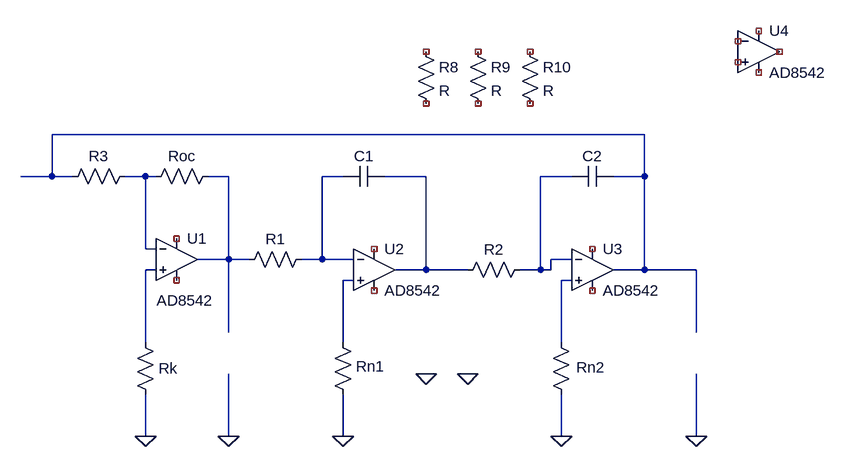
[diagram p0: schematic 3bandFLTR.asc]
3bandFLTR.asc, the LTspice schematic file:
Version 4
SHEET 1 944 680
WIRE 656 -64 -256 -64
WIRE -256 0 -256 -64
WIRE -256 0 -304 0
WIRE -224 0 -256 0
WIRE -112 0 -144 0
WIRE -96 0 -112 0
WIRE 16 0 -16 0
WIRE 192 0 160 0
WIRE 320 0 256 0
WIRE 544 0 496 0
WIRE 656 0 656 -64
WIRE 656 0 608 0
WIRE -112 112 -112 0
WIRE -96 112 -112 112
WIRE 16 128 16 0
WIRE 16 128 -32 128
WIRE 48 128 16 128
WIRE 160 128 160 0
WIRE 160 128 128 128
WIRE 208 128 160 128
WIRE 544 128 512 128
WIRE -96 144 -112 144
WIRE 320 144 320 0
WIRE 320 144 272 144
WIRE 384 144 320 144
WIRE 496 144 496 0
WIRE 496 144 464 144
WIRE 512 144 512 128
WIRE 512 144 496 144
WIRE 656 144 656 0
WIRE 656 144 608 144
WIRE 736 144 656 144
WIRE 208 160 192 160
WIRE 544 160 528 160
WIRE 16 240 16 128
WIRE 736 240 736 144
WIRE -112 256 -112 144
WIRE 192 256 192 160
WIRE 528 256 528 160
WIRE -112 400 -112 336
WIRE 16 400 16 304
WIRE 192 400 192 336
WIRE 528 400 528 336
WIRE 736 400 736 304
FLAG -112 400 0
FLAG 736 400 0
FLAG 192 400 0
FLAG 320 304 0
FLAG 384 304 0
FLAG 16 400 0
FLAG 528 400 0
SYMBOL Opamps\\AD8542 -64 64 R0
WINDOW 3 -31 127 Left 2
SYMATTR InstName U1
SYMBOL Opamps\\AD8542 240 80 R0
SYMATTR InstName U2
SYMBOL Opamps\\AD8542 576 80 R0
SYMATTR InstName U3
SYMBOL Opamps\\AD8542 832 -256 R0
SYMATTR InstName U4
SYMBOL cap 256 -16 R90
WINDOW 0 0 32 VBottom 2
WINDOW 3 32 32 VTop 2
SYMATTR InstName C1
SYMATTR Value ""
SYMBOL cap 544 16 R270
WINDOW 0 32 32 VTop 2
WINDOW 3 0 32 VBottom 2
SYMATTR InstName C2
SYMATTR Value ""
SYMBOL res 144 112 R90
WINDOW 0 0 56 VBottom 2
WINDOW 3 32 56 VTop 2
SYMATTR InstName R1
SYMATTR Value ""
SYMBOL res 480 128 R90
WINDOW 0 0 56 VBottom 2
WINDOW 3 32 56 VTop 2
SYMATTR InstName R2
SYMATTR Value ""
SYMBOL res 512 240 R0
WINDOW 0 39 54 Left 2
SYMATTR InstName Rn2
SYMATTR Value ""
SYMBOL res 176 240 R0
WINDOW 0 36 53 Left 2
SYMATTR InstName Rn1
SYMATTR Value ""
SYMBOL res -128 240 R0
WINDOW 0 36 56 Left 2
SYMATTR InstName Rk
SYMATTR Value ""
SYMBOL res 0 -16 R90
WINDOW 0 0 56 VBottom 2
WINDOW 3 32 56 VTop 2
SYMATTR InstName Roc
SYMATTR Value ""
SYMBOL res -128 -16 R90
WINDOW 0 0 56 VBottom 2
WINDOW 3 32 56 VTop 2
SYMATTR InstName R3
SYMATTR Value ""
SYMBOL res 304 -208 R0
SYMATTR InstName R8
SYMBOL res 384 -208 R0
SYMATTR InstName R9
SYMBOL res 464 -208 R0
SYMATTR InstName R10

The netlist it stands for:
* 3bandFLTR.asc
XU1 N007 N002 NC_01 NC_02 N003 AD8542  ; pins In+ In- V+ V- OUT
XU2 N008 N004 NC_03 NC_04 N005 AD8542  ; pins In+ In- V+ V- OUT
XU3 N009 N006 NC_05 NC_06 N001 AD8542  ; pins In+ In- V+ V- OUT
XU4 NC_07 NC_08 NC_09 NC_10 NC_11 AD8542  ; pins In+ In- V+ V- OUT
C1 N005 N004
C2 N006 N001
R1 N004 N003
R2 N006 N005
Rn2 N009 0
Rn1 N008 0
Rk N007 0
Roc N003 N002
R3 N002 N001
R8 NC_12 NC_13 R
R9 NC_14 NC_15 R
R10 NC_16 NC_17 R
.lib AD8542.sub
.backanno
.end